# Altium project PCB_Clock_STM8.PrjPcb
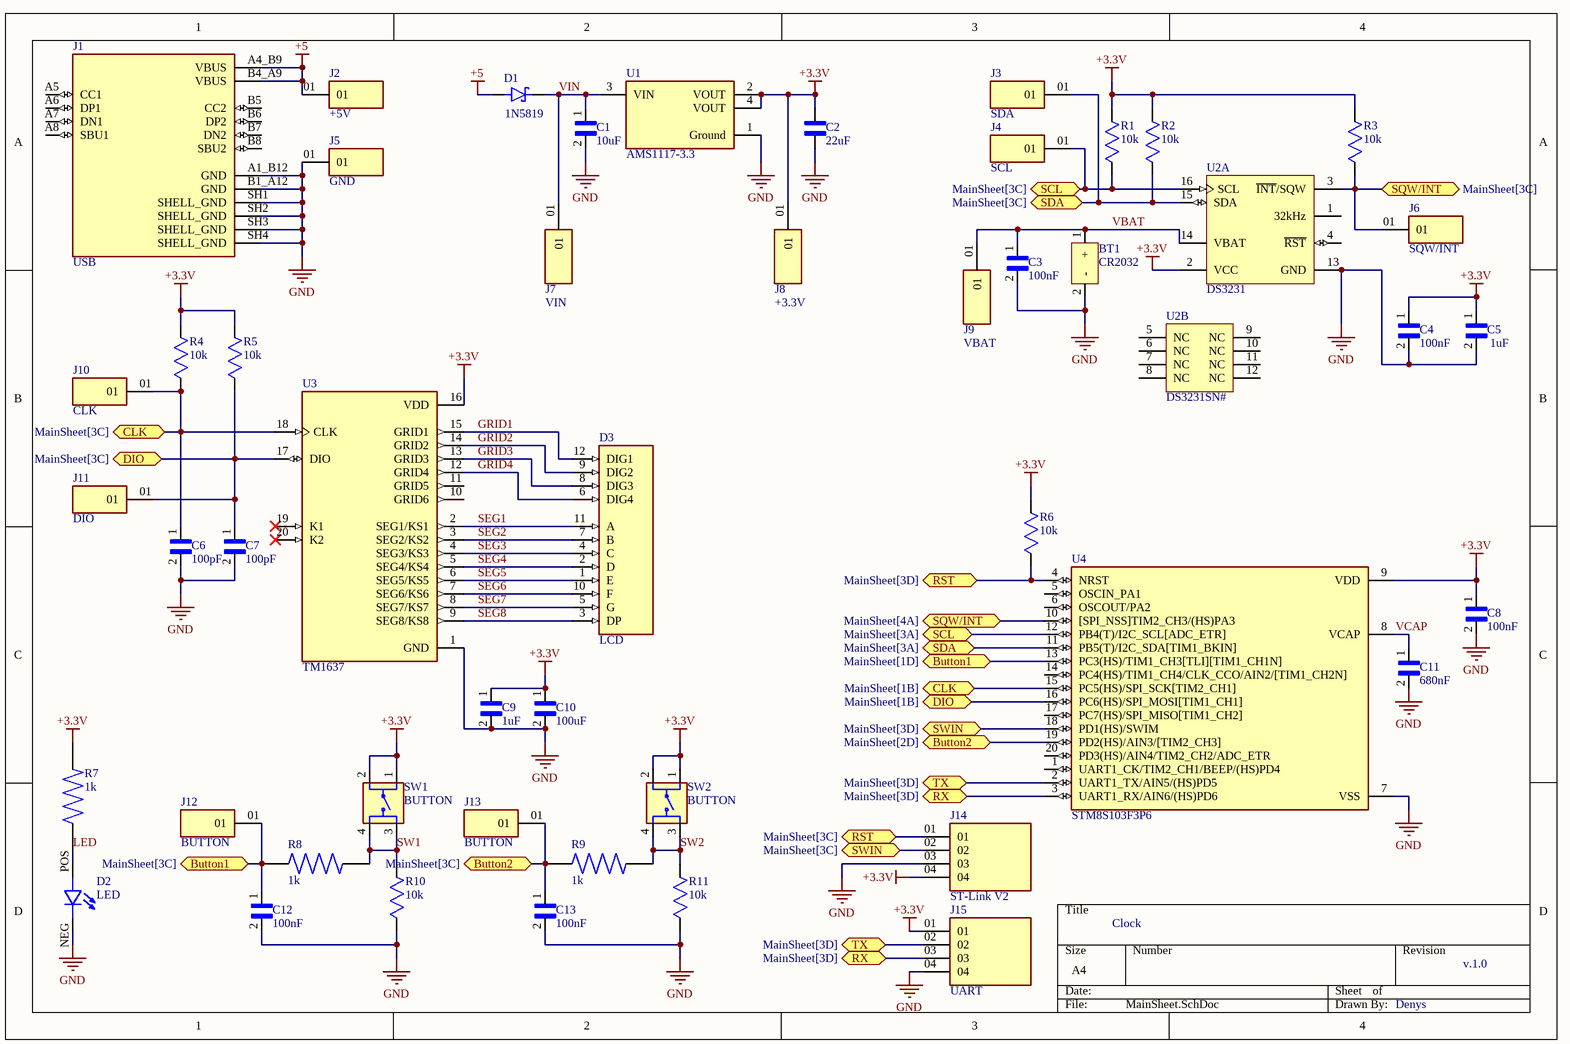
[diagram p0: MainSheet.SchDoc]
1 sheet, 49 parts. Net scope: flat (ports and power ports of the same name join across sheets).
Board file: PCB_Clock_STM8.PcbDoc

## Sheet MainSheet.SchDoc: Clock
size A4; Author: Denys; SheetNumber: 1; SheetTotal: 1; SPICEModelCacheXIKHZQVD: <root> / <DocumentId>XIKHZQVD</DocumentId> / </root>

### Parts
BT1  CR2032  [PCB_Battery]
C1  10uF  [CAPC3216X190]
C2  22uF  [CAPC3216X125N]
C3  100nF  [CAPC3216X180N]
C4  100nF  [CAPC3216X180N]
C5  1uF  [CAPC3216X110N]
C6  100pF  [CAPC3216X110N]
C7  100pF  [CAPC3216X110N]
C8  100nF  [CAPC3216X180N]
C9  1uF  [CAPC3216X110N]
C10  100uF  [CAP3216X125N]
C11  680nF  [CAPC3216X110N]
C12  100nF  [CAPC3216X180N]
C13  100nF  [CAPC3216X180N]
D1  1N5819  [SOD3715X145N]
D2  LED  [LEDC3216X120N]
D3  LCD  [LED_LDQ-M3604RI]
J1  USB  [GCT_USB4105-GF-A]
J2  +5V  [SAMTEC_MTMM-101-X-X-S-X]  (no BOM)
J3  SDA  [SAMTEC_MTMM-101-X-X-S-X]  (no BOM)
J4  SCL  [SAMTEC_MTMM-101-X-X-S-X]  (no BOM)
J5  GND  [SAMTEC_MTMM-101-X-X-S-X]  (no BOM)
J6  SQW/INT  [SAMTEC_MTMM-101-X-X-S-X]  (no BOM)
J7  VIN  [SAMTEC_MTMM-101-X-X-S-X]  (no BOM)
J8  +3.3V  [SAMTEC_MTMM-101-X-X-S-X]  (no BOM)
J9  VBAT  [SAMTEC_MTMM-101-X-X-S-X]  (no BOM)
J10  CLK  [SAMTEC_MTMM-101-X-X-S-X]  (no BOM)
J11  DIO  [SAMTEC_MTMM-101-X-X-S-X]  (no BOM)
J12  BUTTON  [SAMTEC_MTMM-101-X-X-S-X]  (no BOM)
J13  BUTTON  [SAMTEC_MTMM-101-X-X-S-X]  (no BOM)
J14  ST-Link V2  [SAMTEC_TSW-104-07-S-S]  (no BOM)
J15  UART  [SAMTEC_TSW-104-07-S-S]  (no BOM)
R1  10k  [RESC3216X71N]
R2  10k  [RESC3216X71N]
R3  10k  [RESC3216X71N]
R4  10k  [RESC3216X71N]
R5  10k  [RESC3216X71N]
R6  10k  [RESC3216X71N]
R7  1k  [RESC3116X65N]
R8  1k  [RESC3116X65N]
R9  1k  [RESC3116X65N]
R10  10k  [RESC3216X71N]
R11  10k  [RESC3216X71N]
SW1  BUTTON  [TE_4-1437565-9]
SW2  BUTTON  [TE_4-1437565-9]
U1  AMS1117-3.3  [FP-AMS1117-IPC_A]
U2  DS3231  [W16#H2_N]  (parts A,B of 2)
U3  TM1637  [SOIC127P1035X255-20N]
U4  STM8S103F3P6  [SOP65P640X120-20N]

### Ports
Button1 (bidir, see MainSheet[1D]), Button1 (bidir, see MainSheet[3C]), Button2 (bidir, see MainSheet[2D]), Button2 (bidir, see MainSheet[3C]), CLK (bidir, see MainSheet[1B]), CLK (bidir, see MainSheet[3C]), DIO (bidir, see MainSheet[1B]), DIO (bidir, see MainSheet[3C]), RST (bidir, see MainSheet[3C]), RST (bidir, see MainSheet[3D]), RX (bidir, see MainSheet[3D]), SCL (bidir, see MainSheet[3A]), SCL (bidir, see MainSheet[3C]), SDA (bidir, see MainSheet[3A]), SDA (bidir, see MainSheet[3C]), SQW/INT (bidir, see MainSheet[3C]), SQW/INT (bidir, see MainSheet[4A]), SWIN (bidir, see MainSheet[3C]), SWIN (bidir, see MainSheet[3D]), TX (bidir, see MainSheet[3D])

### Nets
+3.3V: C2.2 C4.1 C5.1 C8.1 C9.1 C10.1 J8.01 J14.04 J15.01 R1.1(R1) R2.1(R1) R3.1(R1) R4.1(R1) R5.1(R1) R6.1(R1) R7.2 SW1.1 SW1.2 SW2.1 SW2.2 U1.2(VOUT) U1.4(VOUT) U2.2(VCC) U3.16(VDD) U4.9(VDD)
+5: D1.A J1.A4_B9(VBUS) J1.B4_A9(VBUS) J2.01
GND: BT1.2(-) C1.2 C2.1 C3.2 C4.2 C5.2 C6.2 C7.2 C8.2 C9.2 C10.2 C11.2 C12.2 C13.2 D2.NEG J1.A1_B12(GND) J1.B1_A12(GND) J1.SH1(SHELL_GND) J1.SH2(SHELL_GND) J1.SH3(SHELL_GND) J1.SH4(SHELL_GND) J5.01 J14.03 J15.04 R10.2(R2) R11.2(R2) U1.1(Ground) U2.13(GND) U3.1(GND) U4.7(VSS)
Button1: C12.1 J12.01 R8.2 U4.13(PC3(HS)/TIM1_CH3[TLI][TIM1_CH1N]) ; port Button1
Button2: C13.1 J13.01 R9.2 U4.19(PD2(HS)/AIN3/[TIM2_CH3]) ; port Button2
CLK: C6.1 J10.01 R4.2(R2) U3.18(CLK) U4.15(PC5(HS)/SPI_SCK[TIM2_CH1]) ; port CLK
DIO: C7.1 J11.01 R5.2(R2) U3.17(DIO) U4.16(PC6(HS)/SPI_MOSI[TIM1_CH1]) ; port DIO
GRID1: D3.12(DIG1) U3.15(GRID1)
GRID2: D3.9(DIG2) U3.14(GRID2)
GRID3: D3.8(DIG3) U3.13(GRID3)
GRID4: D3.6(DIG4) U3.12(GRID4)
LED: D2.POS R7.1
RST: J14.01 R6.2(R2) U4.4(NRST) ; port RST
RX: J15.03 U4.3(UART1_RX/AIN6/(HS)PD6) ; port RX
SCL: J4.01 R1.2(R2) U2.16(SCL) U4.12(PB4(T)/I2C_SCL[ADC_ETR]) ; port SCL
SDA: J3.01 R2.2(R2) U2.15(SDA) U4.11(PB5(T)/I2C_SDA[TIM1_BKIN]) ; port SDA
SEG1: D3.11(A) U3.2(SEG1/KS1)
SEG2: D3.7(B) U3.3(SEG2/KS2)
SEG3: D3.4(C) U3.4(SEG3/KS3)
SEG4: D3.2(D) U3.5(SEG4/KS4)
SEG5: D3.1(E) U3.6(SEG5/KS5)
SEG6: D3.10(F) U3.7(SEG6/KS6)
SEG7: D3.5(G) U3.8(SEG7/KS7)
SEG8: D3.3(DP) U3.9(SEG8/KS8)
SQW/INT: J6.01 R3.2(R2) U2.3(~{INT}/SQW) U4.10([SPI_NSS]TIM2_CH3/(HS)PA3) ; port SQW/INT
SW1: R8.1 R10.1(R1) SW1.3 SW1.4
SW2: R9.1 R11.1(R1) SW2.3 SW2.4
SWIN: J14.02 U4.18(PD1(HS)/SWIM) ; port SWIN
TX: J15.02 U4.2(UART1_TX/AIN5/(HS)PD5) ; port TX
VBAT: BT1.1(+) C3.1 J9.01 U2.14(VBAT)
VCAP: C11.1 U4.8(VCAP)
VIN: C1.1 D1.C(K) J7.01 U1.3(VIN)

Not connected (* = marked no-connect by the designer): J1 A5(CC1) A6(DP1) A7(DN1) A8(SBU1) B5(CC2) B6(DP2) B7(DN2) B8(SBU2); U2 1(32kHz) 4(~{RST}) 5(NC) 6(NC) 7(NC) 8(NC) 9(NC) 10(NC) 11(NC) 12(NC); U3 10(GRID6) 11(GRID5) 19(K1)* 20(K2)*; U4 1(UART1_CK/TIM2_CH1/BEEP/(HS)PD4) 5(OSCIN_PA1) 6(OSCOUT/PA2) 14(PC4(HS)/TIM1_CH4/CLK_CCO/AIN2/[TIM1_CH2N]) 17(PC7(HS)/SPI_MISO[TIM1_CH2]) 20(PD3(HS)/AIN4/TIM2_CH2/ADC_ETR)

### Notes on the sheet
- v.1.0

### Library data of the parts
BT1 = Battery: Cell Holder for CR2032
C1 = GRM31CB31E106KA75L: Cap Ceramic 10uF 25V B 10% Pad SMD 1206 85Â°C T/R; Package: None; Price: None; Value: *; MP: GRM31CB31E106KA75L; Availability: Unavailable
C2 = GRM31CR61E226KE15L: CAPACITOR, 1206, X5R, 25V, 22UF; Dielectric Characteristic:X5R; Capacitance:22µF; Capacitance Tolerance:± 10%; Voltage Rating:25V; Series:GRM Hi-Cap; Capacitor Case Style:1206; No. of Pins:2; Capacitor Mounting:SMD; SVHC:No SVHC ;RoHS Compliant: Yes; MP: altium_native_batch; Package: None; Price: None; Value: *; Availability: Unavailable
C3 C4 C8 C12 C13 = CL31B104KBCNNNC: Ceramic capacitor SMD 1206 100 nF 50 V 10 % Samsung Electro-Mechanics CL31B104KBCNNNC 4000 pc(s); MP: CL31B104KBCNNNC; SnapEDA_Link: https://www.snapeda.com/parts/CL31B104KBCNNNC/Samsung+Electro-Mechanics/view-part/?ref=snap; Availability: In Stock; MF: Samsung Electro-Mechanics; Package: 1206 Samsung; Check_prices: https://www.snapeda.com/parts/CL31B104KBCNNNC/Samsung+Electro-Mechanics/view-part/?ref=eda; Value: *; Purchase-URL: https://pricing.snapeda.com/search/part/CL31B104KBCNNNC/?ref=eda; Price: None
C5 C9 = C1206C105J3RACTU: CAP CER 1UF 25V X7R 1206; Package: None; Price: None; Value: *; MP: C1206C105J3RACTU; Availability: Unavailable
C6 C7 = C1206C101JBGACTU: CAP, MLCC, C0G, 100PF, 630V, 1206; Package: None; Price: None; Value: *; MP: C1206C101JBGACTU; Availability: Unavailable
C10 = GRM31CR60J107KE39L: 100µF Â±10% 6.3V Ceramic Capacitor X5R 1206 _3216 Metric_; MF: Murata Electronics; Value: *; SnapEDA_Link: https://www.snapeda.com/parts/GRM31CR60J107KE39L/Murata%20Electronics%20North%20America/view-part/1756509/?ref=snap; Package: 1206 Murata; MP: GRM31CR60J107KE39L; Digi-Key_Purchase_URL: https://www.digikey.com/product-detail/en/murata-electronics/GRM31CR60J107KE39L/490-13982-1-ND/6155812?utm_source=snapeda&utm_medium=aggregator&utm_campaign=symbol; Digi-Key_Part_Number: 490-13982-1-ND
C11 = C1206C684K5RACTU: .68UF 50V 10% 1206; Package: None; Price: None; Value: *; MP: C1206C684K5RACTU; Availability: Unavailable
D1 = 1N5819HW-7: Diode Schottky 40 V 1A Surface Mount SOD-123; MF: Diodes Inc.; SnapEDA_Link: https://www.snapeda.com/parts/1N5819HW-7/Diodes+Inc./view-part/?ref=snap; Price: None; Check_prices: https://www.snapeda.com/parts/1N5819HW-7/Diodes+Inc./view-part/?ref=eda; Availability: In Stock; Value: *; MP: 1N5819HW-7; Package: SOD-123 Fairchild Semiconductor; Purchase-URL: https://pricing.snapeda.com/search/part/1N5819HW-7/?ref=eda
D2 = LHN974_RED_LED_1206: 2.6 V Red LED SMD; MP: LHN974 RED LED 1206; MF: Osram; SnapEDA_Link: https://www.snapeda.com/parts/LHN974%20RED%20LED%201206/Osram/view-part/7899607/?ref=snap; Availability: Not in stock; Price: None; Check_prices: https://www.snapeda.com/parts/LHN974%20RED%20LED%201206/Osram/view-part/7899607/?ref=eda; Value: *; Package: None
D3 = LDQ-M3604RI: Display, Seven Segment, 9.2MM, Red; MF: Lumex; SnapEDA_Link: https://www.snapeda.com/parts/LDQ-M3604RI/Lumex/view-part/?ref=snap; Package: None; Value: *; MP: LDQ-M3604RI; Check_prices: https://www.snapeda.com/parts/LDQ-M3604RI/Lumex/view-part/?ref=eda
J1 = USB4105-GF-A: MF: {'manufacturer': u'GCT'}; Package: None; Price: None; Value: *; MP: USB4105-GF-A; Availability: Unavailable
J2-J13 = MTMM-101-X-X-S-X: Connector Header Through Hole 1 position; MF: Samtec; MP: MTMM-101-05-G-S-225; SnapEDA_Link: https://www.snapeda.com/parts/MTMM-101-05-G-S-225/Samtec/view-part/?ref=snap; Package: None; Value: *; Check_prices: https://www.snapeda.com/parts/MTMM-101-05-G-S-225/Samtec/view-part/?ref=eda
J14 J15 = TSW-104-07-S-S: MF: Samtec Inc.; Package: None; Value: *; Availability: Unavailable; Price: None; MP: TSW-104-07-S-S
R1-R6 R10 R11 = RC1206FR-0710KL: RES, 10K, 1%, 0.25W, 1206, THICK FILM; Resistor Case Style:1206 [3216 Metric]; Resistance:10kohm; Product Range:RC Series; Voltage Rating:200V; Resistor Element Material:Thick Film; Power Rating:250mW; Resistance Tolerance:Â± 1%; Temperature Coefficient:Â± 100ppm/Â°C; Automotive Qualification Standard:-; SVHC:No SVHC (15-Jan-2019); MF: Yageo Corporation; MP: RC1206FR0710KL; SnapEDA_Link: https://www.snapeda.com/parts/RC1206FR0710KL/Yageo/view-part/?ref=snap; Package: 1206-2 YAGEO; Value: *; Check_prices: https://www.snapeda.com/parts/RC1206FR0710KL/Yageo/view-part/?ref=eda
R7-R9 = SR1206FR-071KL: Surge Chip Resistor Automotive Grade Thick Film 1206 1kOhm 1% Paper T/R; MF: Yageo Corporation; MP: SR1206FR071KL; SnapEDA_Link: https://www.snapeda.com/parts/SR1206FR071KL/Yageo/view-part/?ref=snap; Package: 1206-2 YAGEO; Value: *; Check_prices: https://www.snapeda.com/parts/SR1206FR071KL/Yageo/view-part/?ref=eda
SW1 SW2 = 4-1437565-9: Alcoswitch, Switch, Tactile, 50 mA, SPST, Pushbutton, Off[On], FSM6JSMA | TE Connectivity FSM6JSMA; Contact_Current_Rating: 50 mA; Configuration_Pole-Throw: Single Pole - Single Throw; SnapEDA_Link: https://www.snapeda.com/parts/FSM6JSMA/TE+Connectivity+ALCOSWITCH+Switches/view-part/?ref=snap; Package: None; Value: *; MF: TE Connectivity; MP: FSM6JSMA; EU_RoHS_Compliance: Compliant; Check_prices: https://www.snapeda.com/parts/FSM6JSMA/TE+Connectivity+ALCOSWITCH+Switches/view-part/?ref=eda
U1 = CMP-209535-000001-1: LDO Voltage Regulators 1A, 3.3V; Manufacturer: Advanced Monolithic Systems; Dropout Voltage: 1.1V; Output Type: Fixed; Nominal Supply Current: 5mA; Max Power Dissipation: 1.2W; Max Supply Voltage: 15V; Number Of Outputs: 1; Standoff Height: 0.64mm; Max Junction Temp: +125°C; Height: 1.8mm; Package: AMS1117; Device Class L2: Power Management ICs; ComponentLink2Description: Datasheet; ComponentLink2URL: http://www.advanced-monolithic.com/pdf/ds1117.pdf; Category: IC; RoHS: TRUE; Automotive: No; Device Class L1: Integrated Circuits (ICs); Output Current: 1A; Device Class L3: Voltage Regulators - Linear; Temperature: -40°C to +125°C; Output Voltage: 3.3V; Manufacturer Part Number: AMS1117-3.3; Temperature Range Low: -40°C; Octopart: https://octopart.com/ams1117-3.3-advanced+monolithic+systems-25899300; Lead Free: Yes; Ipc Land Pattern Name: SOT229P700X180-4; Temperature Range High: +125°C
U2 = CMP-0254-00293-2: Extremely Accurate I2C-Integrated Real-Time Clock/TCXO/Crystal, 16-Pin SO, -40 to 85 degC, RoHS Qualified; Code_IPC: SOIC127P1030-16; ComponentLink2URL: http://datasheets.maxim-ic.com/en/ds/DS3231.pdf; Code_JEDEC: MS-013-AA; ComponentLink1URL: http://www.maxim-ic.com; ComponentLink2Description: Datasheet; ComponentLink3Description: Package Specification; DatasheetVersion: Rev 8, Jul-2010; PackageVersion: revD, 2010; ComponentLink1Description: Manufacturer URL; PackageDescription: 16-Pin Small-Outline IC, Wide (0.3in), 1.27 mm Pitch, SOIC (W), RoHS Qualified; ComponentLink3URL: http://pdfserv.maxim-ic.com/package_dwgs/21-0042.PDF; PackageReference: W16#H2
U3 = TM1637_SOP20: LED Drive Control Special Circuit; MF: Titan Micro Electronics; SnapEDA_Link: https://www.snapeda.com/parts/TM1637_SOP20/Titan+Micro+Electronics/view-part/?ref=snap; Package: Package; Value: *; MP: TM1637_SOP20; Check_prices: https://www.snapeda.com/parts/TM1637_SOP20/Titan+Micro+Electronics/view-part/?ref=eda
U4 = STM8S103F3P6: STM8 series Microcontroller IC 8-Bit 16MHz 8KB (8K x 8) FLASH 20-TSSOP; MF: STMicroelectronics; SnapEDA_Link: https://www.snapeda.com/parts/STM8S103F3P6/STMicroelectronics/view-part/?ref=snap; Package: TSSOP-20 STMicroelectronics; Value: *; MP: STM8S103F3P6; Check_prices: https://www.snapeda.com/parts/STM8S103F3P6/STMicroelectronics/view-part/?ref=eda